# EAGLE schematic TMP (EAGLE 7.4.0)
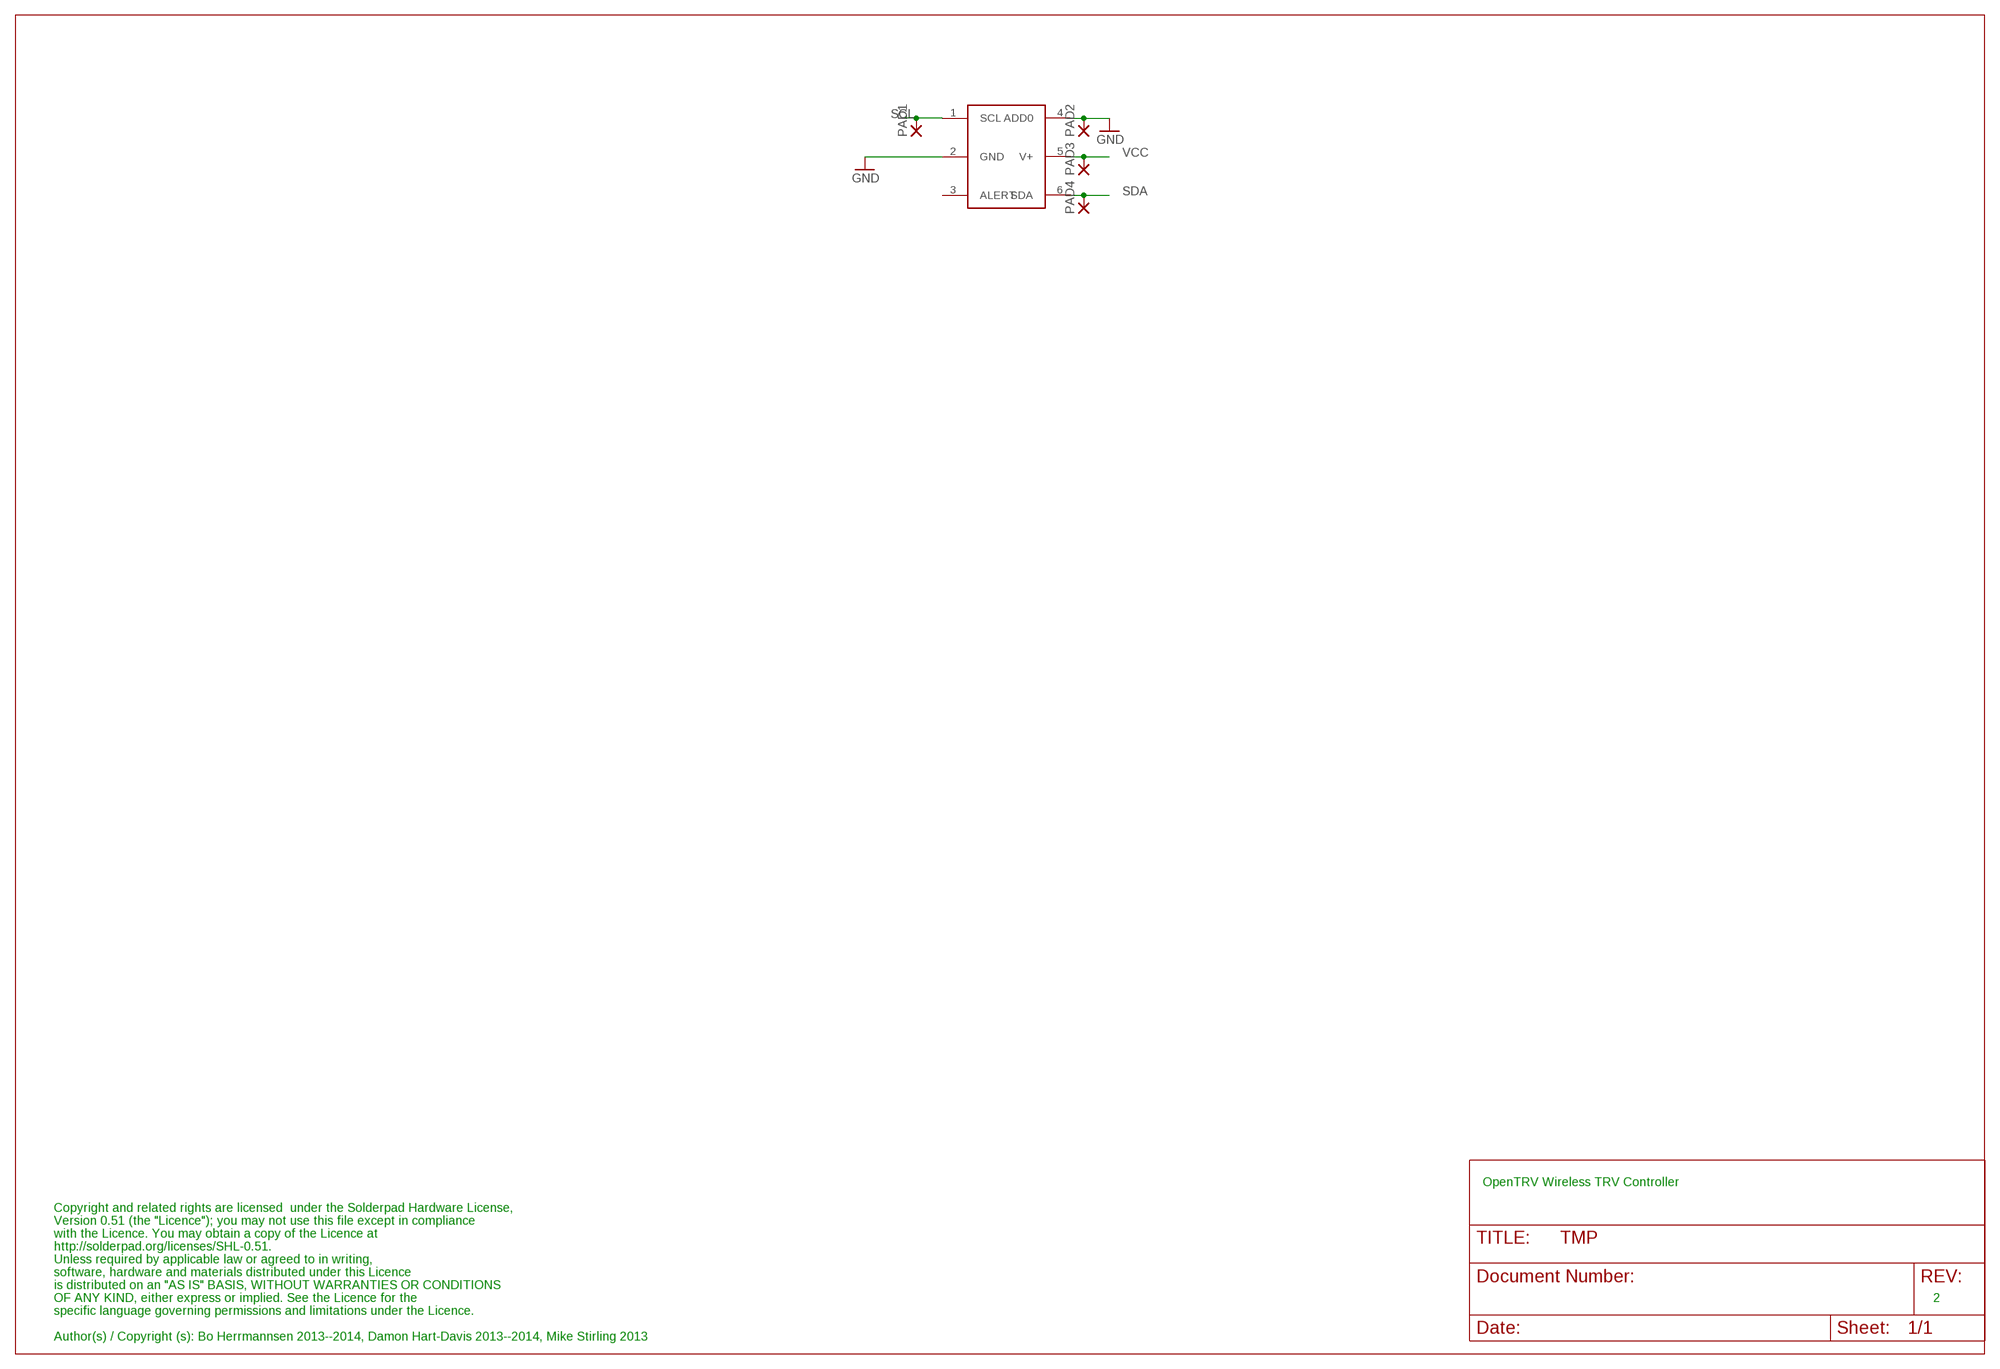
[diagram p0: schematic, sheet 1]

## Parts
PAD1  1,6/0,8  [1,6/0,8]
PAD2  1,6/0,8  [1,6/0,8]
PAD3  1,6/0,8  [1,6/0,8]
PAD4  1,6/0,8  [1,6/0,8]
TMP1  TMP1  TMP112  [TMP112]

## Nets
GND [supply]: PAD2.1(P) TMP1.2(GND) TMP1.4(ADD0)
SCL: PAD1.1(P) TMP1.1(SCL)
SDA: PAD4.1(P) TMP1.6(SDA)
VCC [supply]: PAD3.1(P) TMP1.5(V+)
Unconnected: TMP1.3(ALERT)

## Notes on the sheet
- OpenTRV Wireless TRV Controller
- Copyright and related rights are licensed  under the Solderpad Hardware License,
- Version 0.51 (the "Licence"); you may not use this file except in compliance
- with the Licence. You may obtain a copy of the Licence at
- http://solderpad.org/licenses/SHL-0.51.
- Unless required by applicable law or agreed to in writing,
- software, hardware and materials distributed under this Licence
- is distributed on an "AS IS" BASIS, WITHOUT WARRANTIES OR CONDITIONS
- OF ANY KIND, either express or implied. See the Licence for the | 2
- specific language governing permissions and limitations under the Licence.
- Author(s) / Copyright (s): Bo Herrmannsen 2013--2014, Damon Hart-Davis 2013--2014, Mike Stirling 2013

## Library data of the parts
PAD1-PAD4 = wirepad:1,6/0,8: THROUGH-HOLE PAD
TMP1 = TMP112:TMP112

## Net classes
0 default: width 0.203 mm
1 supply: width 0.406 mm, clearance 0.203 mm
2 ant: width 2.184 mm